# Altium schematic sheet sdram.SchDoc
size A4
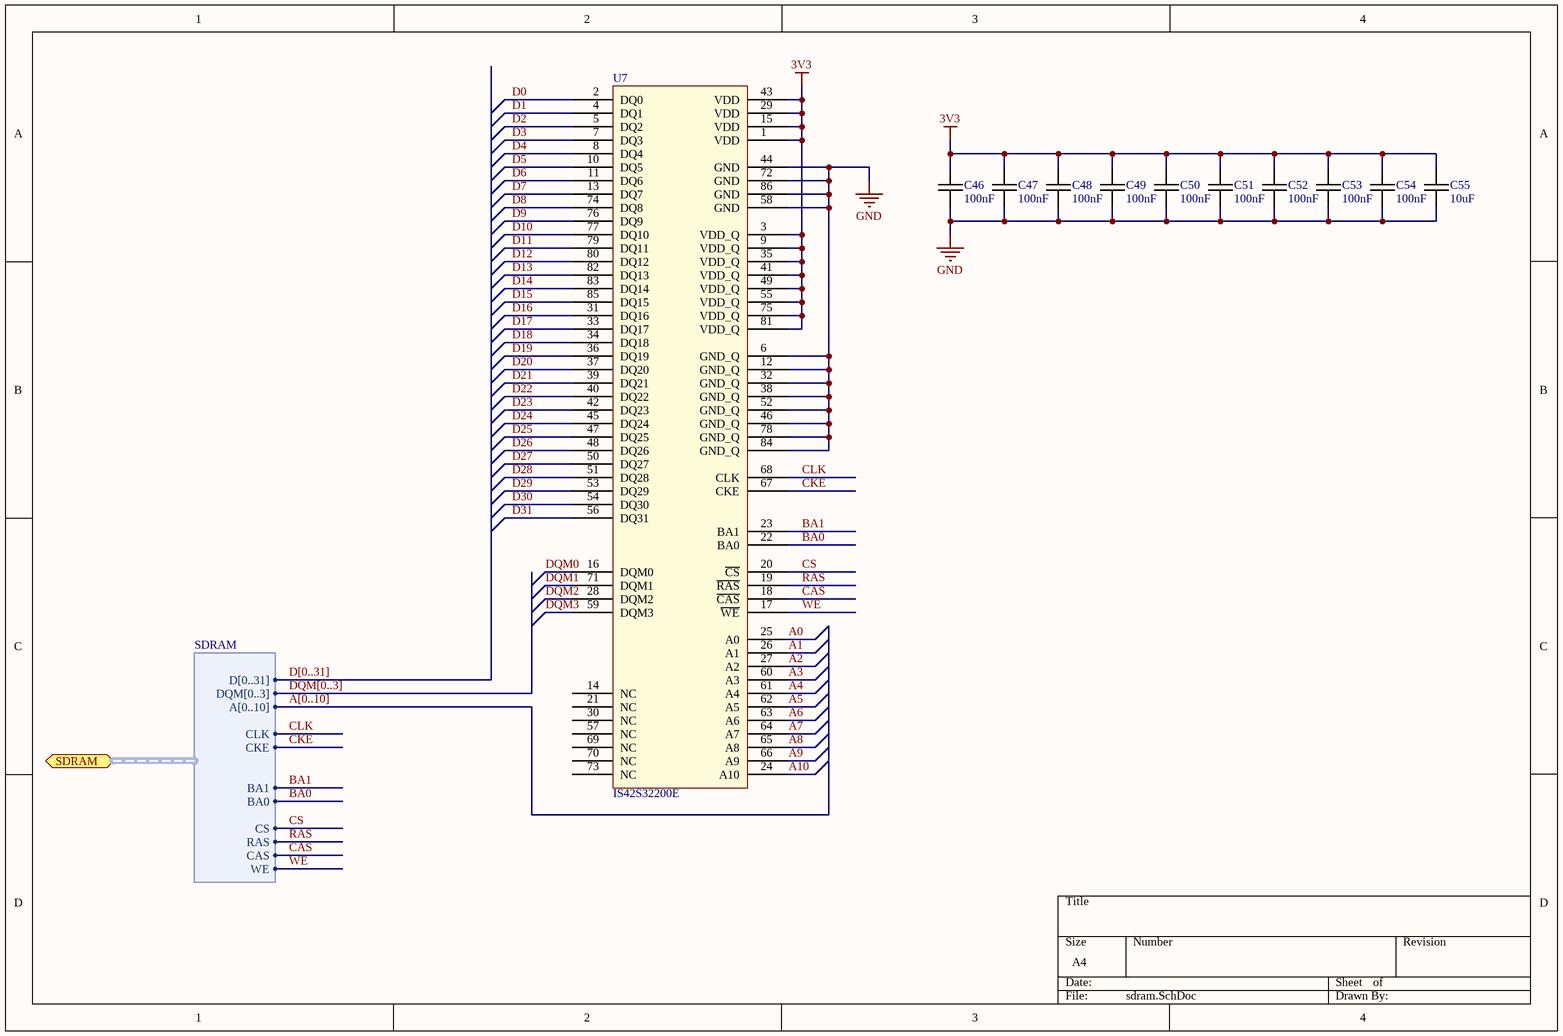
[diagram p0: sdram.SchDoc]

## Parts
C46  100nF  [0603C-GENERIC]
C47  100nF  [0603C-GENERIC]
C48  100nF  [0603C-GENERIC]
C49  100nF  [0603C-GENERIC]
C50  100nF  [0603C-GENERIC]
C51  100nF  [0603C-GENERIC]
C52  100nF  [0603C-GENERIC]
C53  100nF  [0603C-GENERIC]
C54  100nF  [0603C-GENERIC]
C55  10uF  [0805C-GENERIC]
U7  IS42S32200E  [TSSOP50P1175-86M]

## Ports
SDRAM (harness SDRAM)

## Harnesses
SDRAM: D[0..31], DQM[0..3], A[0..10], CLK, CKE, BA1, BA0, CS, RAS, CAS, WE

## Nets
3V3: C46.1 C47.1 C48.1 C49.1 C50.1 C51.1 C52.1 C53.1 C54.1 C55.1 U7.1(VDD) U7.3(VDD_Q) U7.9(VDD_Q) U7.15(VDD) U7.29(VDD) U7.35(VDD_Q) U7.41(VDD_Q) U7.43(VDD) U7.49(VDD_Q) U7.55(VDD_Q) U7.75(VDD_Q) U7.81(VDD_Q)
GND: C46.2 C47.2 C48.2 C49.2 C50.2 C51.2 C52.2 C53.2 C54.2 C55.2 U7.6(GND_Q) U7.12(GND_Q) U7.32(GND_Q) U7.38(GND_Q) U7.44(GND) U7.46(GND_Q) U7.52(GND_Q) U7.58(GND) U7.72(GND) U7.78(GND_Q) U7.84(GND_Q) U7.86(GND)
A0: U7.25(A0)
A1: U7.26(A1)
A2: U7.27(A2)
A3: U7.60(A3)
A4: U7.61(A4)
A5: U7.62(A5)
A6: U7.63(A6)
A7: U7.64(A7)
A8: U7.65(A8)
A9: U7.66(A9)
A10: U7.24(A10)
BA0: U7.22(BA0) ; port SDRAM.BA0
BA1: U7.23(BA1) ; port SDRAM.BA1
CAS: U7.18(~{CAS}) ; port SDRAM.CAS
CKE: U7.67(CKE) ; port SDRAM.CKE
CLK: U7.68(CLK) ; port SDRAM.CLK
CS: U7.20(~{CS}) ; port SDRAM.CS
D0: U7.2(DQ0)
D1: U7.4(DQ1)
D2: U7.5(DQ2)
D3: U7.7(DQ3)
D4: U7.8(DQ4)
D5: U7.10(DQ5)
D6: U7.11(DQ6)
D7: U7.13(DQ7)
D8: U7.74(DQ8)
D9: U7.76(DQ9)
D10: U7.77(DQ10)
D11: U7.79(DQ11)
D12: U7.80(DQ12)
D13: U7.82(DQ13)
D14: U7.83(DQ14)
D15: U7.85(DQ15)
D16: U7.31(DQ16)
D17: U7.33(DQ17)
D18: U7.34(DQ18)
D19: U7.36(DQ19)
D20: U7.37(DQ20)
D21: U7.39(DQ21)
D22: U7.40(DQ22)
D23: U7.42(DQ23)
D24: U7.45(DQ24)
D25: U7.47(DQ25)
D26: U7.48(DQ26)
D27: U7.50(DQ27)
D28: U7.51(DQ28)
D29: U7.53(DQ29)
D30: U7.54(DQ30)
D31: U7.56(DQ31)
DQM0: U7.16(DQM0)
DQM1: U7.71(DQM1)
DQM2: U7.28(DQM2)
DQM3: U7.59(DQM3)
RAS: U7.19(~{RAS}) ; port SDRAM.RAS
WE: U7.17(~{WE}) ; port SDRAM.WE

Not connected (* = marked no-connect by the designer): U7 14(NC) 21(NC) 30(NC) 57(NC) 69(NC) 70(NC) 73(NC)

## Buses and harness runs
bus A[0..10]
bus D[0..31]
bus DQM[0..3]

## Library data of the parts
C46-C54 = 0603C-100NF-50V-X7R-TDK: GENERIC CAPACITOR NON POLARISED 0603; Manufacturer Part Number: C1608X7R1H103K; Manufacturer: TDK Corporation; Temperature Coefficient: X7R; Tolerance: ±10%; Voltage - Rated: 50V; Capacitance: 10000pF; Description: CAP CER 10000PF 50V X7R 10% 0603; Reel: C68; RoHS: RoHS Compliant; Lead Spacing: -; Package / Case: 0603 (1608 metric); Features: General Purpose; Packaging: Tape & Reel (TR); Thickness: 0.80mm; Operating Temperature: -55°C ~ 125°C; Mounting Type: Surface Mount, MLCC; Category: Capacitors; Supplier 1: Digi-Key; Supplier Part Number 1: 445-1314-2-ND
C55 = 0805C-10UF-16V-X5R-TDK: CAPACITOR 0805 CERAMIC; Manufacturer Part Number: C2012X5R1C106M; Manufacturer: TDK Corporation; REEL: C63; Description: CAP CER 10UF 16V X5R 0805; Supplier 1: Digi-Key; Supplier Part Number 1: 445-4115-2-ND